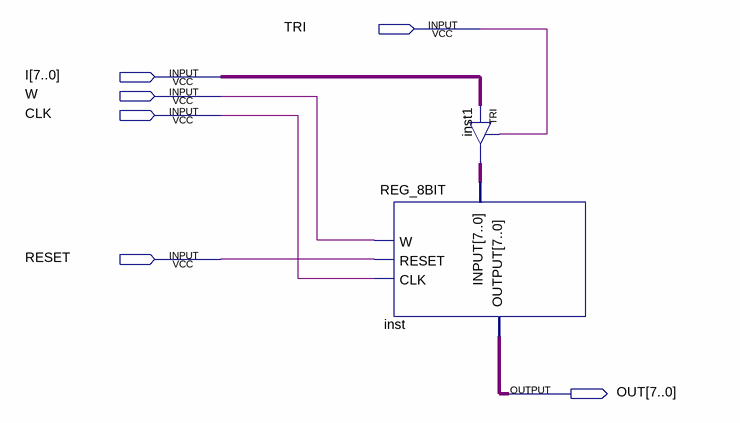
[diagram p0: schematic sheet]
// Quartus schematic TEST.bdf as structural Verilog: 2 symbols, 6 pins
module TEST (
  input  TRI,
  input  [7:0] I,
  input  W,
  input  CLK,
  input  RESET,
  output [7:0] OUT
);

  wire [7:0] inst1_out;

  REG_8BIT inst (.W(W), .INPUT(inst1_out), .RESET(RESET), .CLK(CLK), .OUTPUT(OUT));
  TRI inst1[7:0] (.IN(I), .OE(TRI), .OUT(inst1_out));
endmodule
